# Altium schematic sheet 04_Supply_Monitoring.SchDoc
size A2
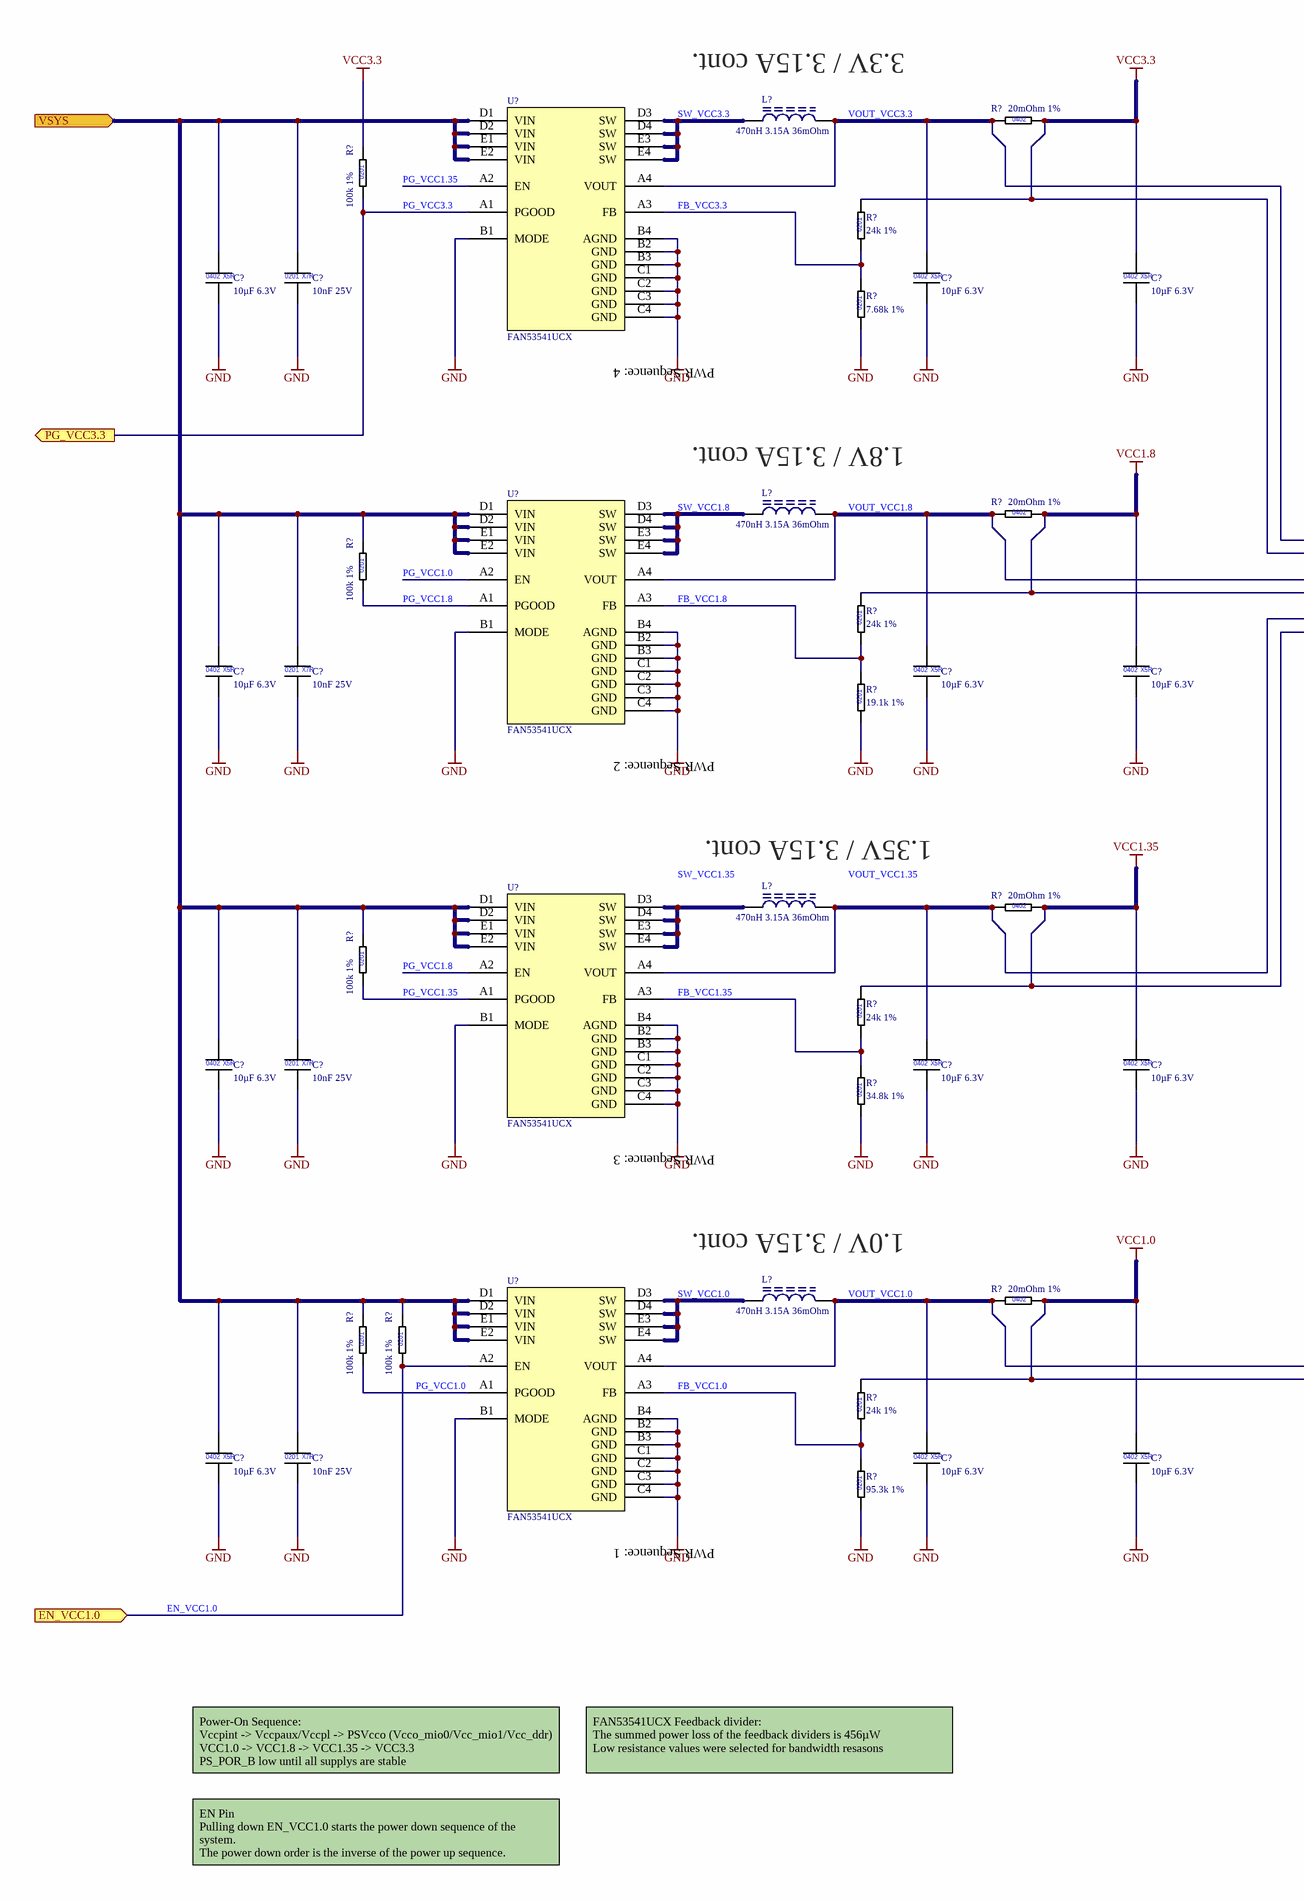
[diagram p0: 04_Supply_Monitoring.SchDoc, left]
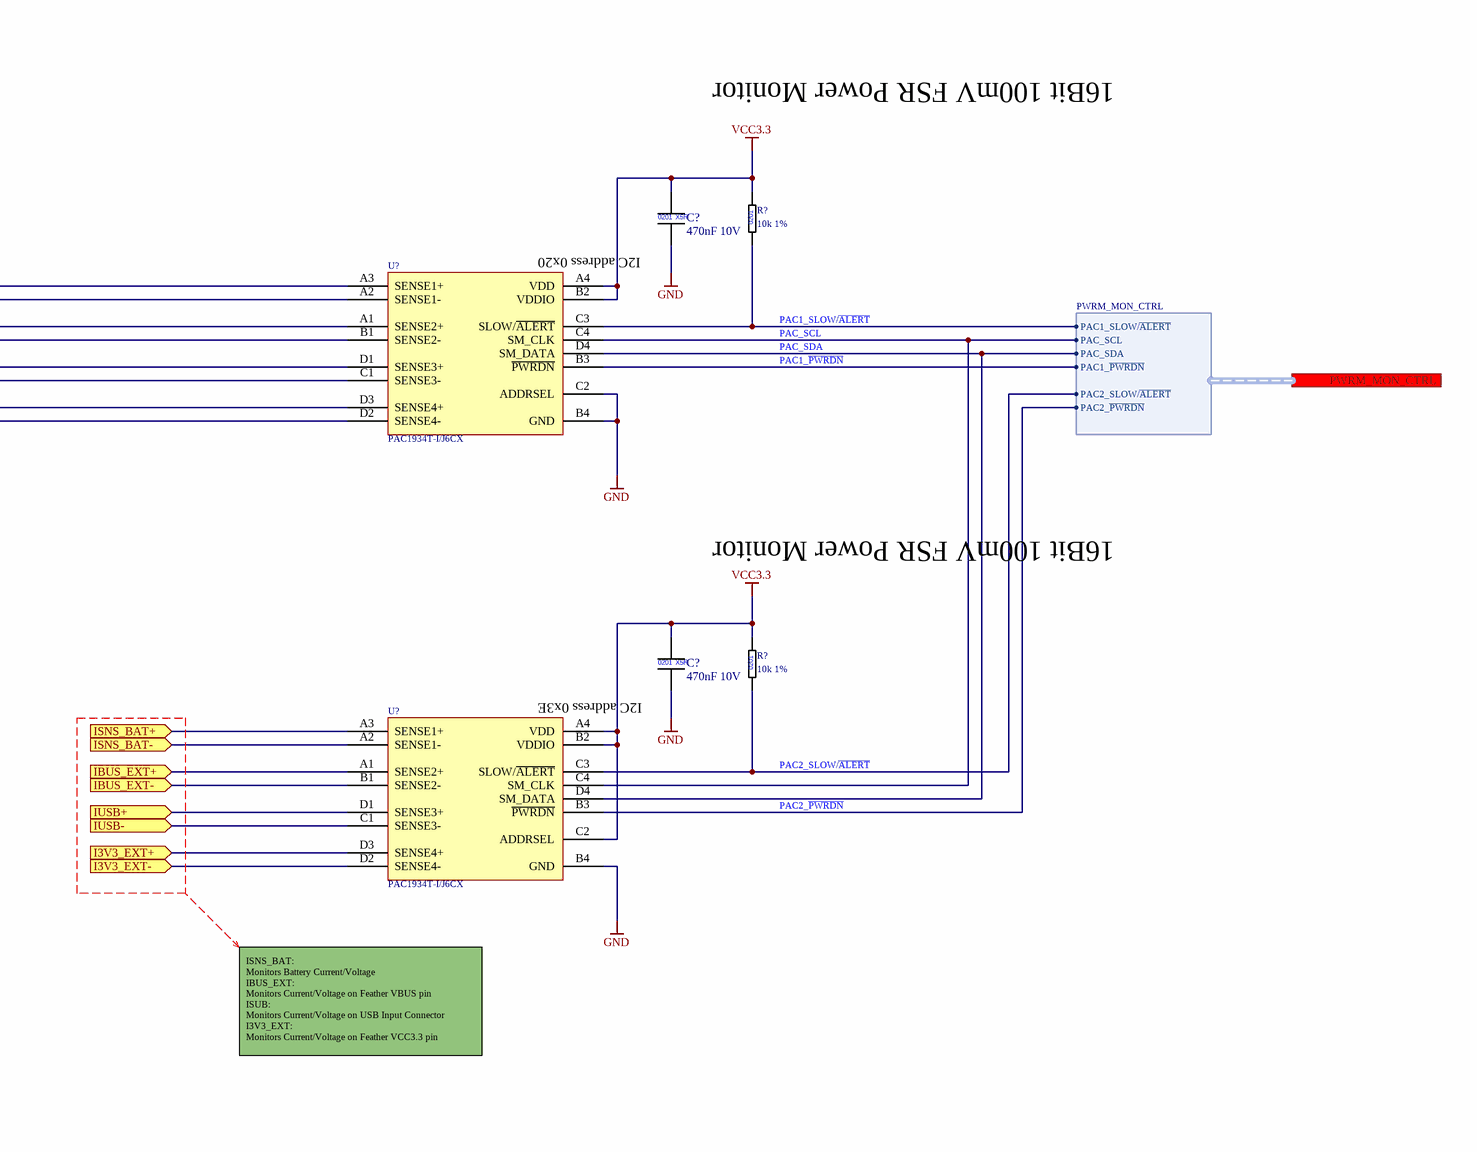
[diagram p1: 04_Supply_Monitoring.SchDoc, right]

## Parts
(Parts that share a designator on the sheet are numbered #1, #2 ... from top to bottom, then left to right.)
C?#1  10µF 6.3V  [CAPC1005X06L]
C?#2  10nF 25V  [CAPC0603X03L]
C?#3  10µF 6.3V  [CAPC1005X06L]
C?#4  10µF 6.3V  [CAPC1005X06L]
C?#5  470nF 10V  [CAPC0603X03L]
C?#6  10µF 6.3V  [CAPC1005X06L]
C?#7  10nF 25V  [CAPC0603X03L]
C?#8  10µF 6.3V  [CAPC1005X06L]
C?#9  10µF 6.3V  [CAPC1005X06L]
C?#10  470nF 10V  [CAPC0603X03L]
C?#11  10µF 6.3V  [CAPC1005X06L]
C?#12  10nF 25V  [CAPC0603X03L]
C?#13  10µF 6.3V  [CAPC1005X06L]
C?#14  10µF 6.3V  [CAPC1005X06L]
C?#15  10µF 6.3V  [CAPC1005X06L]
C?#16  10nF 25V  [CAPC0603X03L]
C?#17  10µF 6.3V  [CAPC1005X06L]
C?#18  10µF 6.3V  [CAPC1005X06L]
L?#1  470nH 3.15A 36mOhm  [INDC2013X08L]
L?#2  470nH 3.15A 36mOhm  [INDC2013X08L]
L?#3  470nH 3.15A 36mOhm  [INDC2013X08L]
L?#4  470nH 3.15A 36mOhm  [INDC2013X08L]
R?#1  20mOhm 1%  [RESC1005X04L]
R?#2  100k 1%  [RESC0603X03L]
R?#3  24k 1%  [RESC0603X03L]
R?#4  7.68k 1%  [RESC0603X03L]
R?#5  10k 1%  [RESC0603X03L]
R?#6  20mOhm 1%  [RESC1005X04L]
R?#7  100k 1%  [RESC0603X03L]
R?#8  24k 1%  [RESC0603X03L]
R?#9  19.1k 1%  [RESC0603X03L]
R?#10  20mOhm 1%  [RESC1005X04L]
R?#11  10k 1%  [RESC0603X03L]
R?#12  100k 1%  [RESC0603X03L]
R?#13  24k 1%  [RESC0603X03L]
R?#14  34.8k 1%  [RESC0603X03L]
R?#15  20mOhm 1%  [RESC1005X04L]
R?#16  100k 1%  [RESC0603X03L]
R?#17  100k 1%  [RESC0603X03L]
R?#18  24k 1%  [RESC0603X03L]
R?#19  95.3k 1%  [RESC0603X03L]
U?#1  FAN53541UCX  [BGA20C40P4X5_156X196X59]
U?#2  PAC1934T-I/J6CX  [BGA16C50P4X4_222X217X68]
U?#3  FAN53541UCX  [BGA20C40P4X5_156X196X59]
U?#4  FAN53541UCX  [BGA20C40P4X5_156X196X59]
U?#5  PAC1934T-I/J6CX  [BGA16C50P4X4_222X217X68]
U?#6  FAN53541UCX  [BGA20C40P4X5_156X196X59]

## Ports
EN_VCC1.0 (in), I3V3_EXT+ (in), I3V3_EXT- (in), IBUS_EXT+ (in), IBUS_EXT- (in), ISNS_BAT+ (in), ISNS_BAT- (in), IUSB+ (in), IUSB- (in), PG_VCC3.3 (out), PWRM_MON_CTRL (harness PWRM_MON_CTRL), VSYS (in)

## Harnesses
PWRM_MON_CTRL: PAC1_SLOW/~{ALERT}, PAC_SCL, PAC1_~{PWRDN}, PAC_SDA, PAC2_SLOW/~{ALERT}, PAC2_~{PWRDN}

## Nets
GND: C?#1.2 C?#2.2 C?#3.2 C?#4.2 C?#5.2 C?#6.2 C?#7.2 C?#8.2 C?#9.2 C?#10.2 C?#11.2 C?#12.2 C?#13.2 C?#14.2 C?#15.2 C?#16.2 C?#17.2 C?#18.2 R?#4.1 R?#9.1 R?#14.1 R?#19.1 U?#1.B1(MODE) U?#1.B2(GND) U?#1.B3(GND) U?#1.B4(AGND) U?#1.C1(GND) U?#1.C2(GND) U?#1.C3(GND) U?#1.C4(GND) U?#2.B4(GND) U?#2.C2(ADDRSEL) U?#3.B1(MODE) U?#3.B2(GND) U?#3.B3(GND) U?#3.B4(AGND) U?#3.C1(GND) U?#3.C2(GND) U?#3.C3(GND) U?#3.C4(GND) U?#4.B1(MODE) U?#4.B2(GND) U?#4.B3(GND) U?#4.B4(AGND) U?#4.C1(GND) U?#4.C2(GND) U?#4.C3(GND) U?#4.C4(GND) U?#5.B4(GND) U?#6.B1(MODE) U?#6.B2(GND) U?#6.B3(GND) U?#6.B4(AGND) U?#6.C1(GND) U?#6.C2(GND) U?#6.C3(GND) U?#6.C4(GND)
VCC1.0: C?#18.1 R?#15.2 R?#18.2 U?#2.D2(SENSE4-)
VCC1.8: C?#9.1 R?#6.2 R?#8.2 U?#2.B1(SENSE2-)
VCC1.35: C?#14.1 R?#10.2 R?#13.2 U?#2.C1(SENSE3-)
VCC3.3: C?#4.1 C?#5.1 C?#10.1 R?#1.2 R?#2.2 R?#3.2 R?#5.2 R?#11.2 U?#2.A2(SENSE1-) U?#2.A4(VDD) U?#2.B2(VDDIO) U?#5.A4(VDD) U?#5.B2(VDDIO) U?#5.C2(ADDRSEL)
EN_VCC1.0: R?#17.1 U?#6.A2(EN) ; port EN_VCC1.0
FB_VCC1.0: R?#18.1 R?#19.2 U?#6.A3(FB)
FB_VCC1.8: R?#8.1 R?#9.2 U?#3.A3(FB)
FB_VCC1.35: R?#13.1 R?#14.2 U?#4.A3(FB)
FB_VCC3.3: R?#3.1 R?#4.2 U?#1.A3(FB)
I3V3_EXT+: U?#5.D3(SENSE4+) ; port I3V3_EXT+
I3V3_EXT-: U?#5.D2(SENSE4-) ; port I3V3_EXT-
IBUS_EXT+: U?#5.A1(SENSE2+) ; port IBUS_EXT+
IBUS_EXT-: U?#5.B1(SENSE2-) ; port IBUS_EXT-
ISNS_BAT+: U?#5.A3(SENSE1+) ; port ISNS_BAT+
ISNS_BAT-: U?#5.A2(SENSE1-) ; port ISNS_BAT-
IUSB+: U?#5.D1(SENSE3+) ; port IUSB+
IUSB-: U?#5.C1(SENSE3-) ; port IUSB-
PAC1_~{PWRDN}: U?#2.B3(~{PWRDN}) ; port PWRM_MON_CTRL.PAC1_~{PWRDN}
PAC1_SLOW/~{ALERT}: R?#5.1 U?#2.C3(SLOW/~{ALERT}) ; port PWRM_MON_CTRL.PAC1_SLOW/~{ALERT}
PAC2_~{PWRDN}: U?#5.B3(~{PWRDN}) ; port PWRM_MON_CTRL.PAC2_~{PWRDN}
PAC2_SLOW/~{ALERT}: R?#11.1 U?#5.C3(SLOW/~{ALERT}) ; port PWRM_MON_CTRL.PAC2_SLOW/~{ALERT}
PAC_SCL: U?#2.C4(SM_CLK) U?#5.C4(SM_CLK) ; port PWRM_MON_CTRL.PAC_SCL
PAC_SDA: U?#2.D4(SM_DATA) U?#5.D4(SM_DATA) ; port PWRM_MON_CTRL.PAC_SDA
PG_VCC1.0: R?#16.1 U?#3.A2(EN) U?#6.A1(PGOOD)
PG_VCC1.8: R?#7.1 U?#3.A1(PGOOD) U?#4.A2(EN)
PG_VCC1.35: R?#12.1 U?#1.A2(EN) U?#4.A1(PGOOD)
PG_VCC3.3: R?#2.1 U?#1.A1(PGOOD) ; port PG_VCC3.3
SW_VCC1.0: L?#4.1 U?#6.D3(SW) U?#6.D4(SW) U?#6.E3(SW) U?#6.E4(SW)
SW_VCC1.8: L?#2.1 U?#3.D3(SW) U?#3.D4(SW) U?#3.E3(SW) U?#3.E4(SW)
SW_VCC3.3: L?#1.1 U?#1.D3(SW) U?#1.D4(SW) U?#1.E3(SW) U?#1.E4(SW)
VOUT_VCC1.0: C?#17.1 L?#4.2 R?#15.1 U?#2.D3(SENSE4+) U?#6.A4(VOUT)
VOUT_VCC1.8: C?#8.1 L?#2.2 R?#6.1 U?#2.A1(SENSE2+) U?#3.A4(VOUT)
VOUT_VCC3.3: C?#3.1 L?#1.2 R?#1.1 U?#1.A4(VOUT) U?#2.A3(SENSE1+)
VSYS: C?#1.1 C?#2.1 C?#6.1 C?#7.1 C?#11.1 C?#12.1 C?#15.1 C?#16.1 R?#7.2 R?#12.2 R?#16.2 R?#17.2 U?#1.D1(VIN) U?#1.D2(VIN) U?#1.E1(VIN) U?#1.E2(VIN) U?#3.D1(VIN) U?#3.D2(VIN) U?#3.E1(VIN) U?#3.E2(VIN) U?#4.D1(VIN) U?#4.D2(VIN) U?#4.E1(VIN) U?#4.E2(VIN) U?#6.D1(VIN) U?#6.D2(VIN) U?#6.E1(VIN) U?#6.E2(VIN) ; port VSYS
NetC?#13_1: C?#13.1 L?#3.2 R?#10.1 U?#2.D1(SENSE3+) U?#4.A4(VOUT)
NetL?#3_1: L?#3.1 U?#4.D3(SW) U?#4.D4(SW) U?#4.E3(SW) U?#4.E4(SW)

## Notes on the sheet
- (near U?#1) 3.3V / 3.15A cont.
- (near U?#1) PWR Sequence: 4
- 16Bit 100mV FSR Power Monitor
- (near U?#3) 1.8V / 3.15A cont.
- (near U?#2) I2C address 0x20
- (near U?#3) PWR Sequence: 2
- (near U?#4) 1.35V / 3.15A cont.
- (near U?#5) I2C address 0x3E
- (near U?#4) PWR Sequence: 3
- (near U?#6) 1.0V / 3.15A cont.
- ISNS_BAT:
  Monitors Battery Current/Voltage
  IBUS_EXT:
  Monitors Current/Voltage on Feather VBUS pin
  ISUB:
  Monitors Current/Voltage on USB Input Connector
  I3V3_EXT:
  Monitors Current/Voltage on Feather VCC3.3 pin
- (near U?#6) PWR Sequence: 1
- Power-On Sequence:
  Vccpint -> Vccpaux/Vccpl -> PSVcco (Vcco_mio0/Vcc_mio1/Vcc_ddr)
  VCC1.0 -> VCC1.8 -> VCC1.35 -> VCC3.3
  PS_POR_B low until all supplys are stable
- FAN53541UCX Feedback divider:
  The summed power loss of the feedback dividers is 456µW
  Low resistance values were selected for bandwidth resasons
- EN Pin
  Pulling down EN_VCC1.0 starts the power down sequence of the system.
  The power down order is the inverse of the power up sequence.
  Floating the EN_VCC1.0 signal starts the power up sequence
- Labels drawn without touching a wire or pin: SW_VCC1.35, VOUT_VCC1.35
- Title:
- ++CONFIDENTIAL++
- The  information  contained  in  these  documents  is  confidential,  privileged  and  only  for  the
  information of the intended recipient and may
  not be used, published or redistributed without
  the prior written consent from PCB Arts GmbH.
- Datum:
- Revision:
- Blatt:
- von:
- Zeit:
- Entwickler:
- Checked:
- Der transparenteste Entwicklungsdienstleister
  der Elektronik- und Softwareentwicklung
- https://pcb-arts.com/
- mail@pcb-arts.com
- (in symbol CAP_0201_10nF_25V) 0201; X7R
- (in symbol CAP_0201_470nF_10V) 0201; X5R
- (in symbol CAP_0402_10µ_6.3V) 0402; X5R
- (in symbol RES_0201_7.68k_1%) 0201
- (in symbol RES_0201_10k_1%) 0201
- (in symbol RES_0201_19.1k_1%) 0201
- (in symbol RES_0201_24k_1%) 0201
- (in symbol RES_0201_34.8k_1%) 0201
- (in symbol RES_0201_95.3k_1%) 0201
- (in symbol RES_0201_100k_1%) 0201
- (in symbol RES_0402_20mR_1%) 0402

## Library data of the parts
C?#1 C?#3 C?#4 C?#6 C?#8 C?#9 C?#11 C?#13-C?#15 C?#17 C?#18 = CAP_0402_10µ_6.3V: Multilayer Ceramic Capacitors MLCC - SMD/SMT 0402 6.3VDC; Manufacturer 1: Murata Electronics; Manufacturer 1 Prt. Nr.: GRM155C80J106ME11J; Manufacturer 2 Prt. Nr.: JMK105CBJ106MV-F; Manufacturer 2: Taiyo Yuden
C?#2 C?#7 C?#12 C?#16 = CAP_0201_10nF_25V: Multilayer Ceramic Capacitors MLCC - SMD/SMT 0201 25VDC; Manufacturer: Murata Electronics; Manufacturer Prt. Nr.: GRM033C81E103KE14D; Manufacturer 2: AVX; Manufacturer Prt. Nr. 2: 02013C103KAT2A
C?#5 C?#10 = CAP_0201_470nF_10V: Multilayer Ceramic Capacitors MLCC - SMD/SMT 0201 10VDC; Manufacturer 1: Taiyo Yuden; Manufacturer 1 Prt. Nr.: LMK063BBJ474KPLF; Manufacturer 2 Prt. Nr.: C0603X5R1A474M030BC; Manufacturer 2: TDK
L?#1-L?#4 = IND_0805_470nH_3.15A: Fixed Inductors 0805 .47uH 3.15A 20% 36mOhms HiCur; Manufacturer Prt. Nr.: MCHK2012TR47M; Manufacturer: Taiyo Yuden
R?#1 R?#6 R?#10 R?#15 = RES_0402_20mR_1%: Thick Film Resistors - SMD 20mOHM 1%; Manufacturer 1: Yageo; Manufacturer 1 Prt. Nr.: PA0402FRL7T0R02L
R?#2 R?#7 R?#12 R?#16 R?#17 = RES_0201_100k_1%: Thick Film Resistors - SMD 100K OHM 1%; Manufacturer 1: Yageo; Manufacturer 1 Prt. Nr.: RC0201FR-07100KL; Manufacturer 2 Prt. Nr.: CRCW0201100KFNED; Manufacturer 2: Vishay / Dale
R?#3 R?#8 R?#13 R?#18 = RES_0201_24k_1%: Thick Film Resistors - SMD 24K OHM 1%; Manufacturer 1: Yageo; Manufacturer 1 Prt. Nr.: RC0201FR-0724KL; Manufacturer 2 Prt. Nr.: CRCW020124K0FKED; Manufacturer 2: Vishay / Dale
R?#4 = RES_0201_7.68k_1%: Thick Film Resistors - SMD 7.68K OHM 1%; Manufacturer 1: Yageo; Manufacturer 1 Prt. Nr.: RC0201FR-077K68L; Manufacturer 2 Prt. Nr.: CRCW02017K68FKED; Manufacturer 2: Vishay / Dale
R?#5 R?#11 = RES_0201_10k_1%: Thick Film Resistors - SMD 10K OHM 1%; Manufacturer 1: Yageo; Manufacturer 1 Prt. Nr.: RC0201FR-0710KL; Manufacturer 2 Prt. Nr.: CRCW020110K0FNED; Manufacturer 2: Vishay / Dale
R?#9 = RES_0201_19.1k_1%: Thick Film Resistors - SMD 19.1K OHM 1%; Manufacturer 1: Yageo; Manufacturer 1 Prt. Nr.: RC0201FR-0719K1L; Manufacturer 2 Prt. Nr.: CRCW020119K1FKED; Manufacturer 2: Vishay / Dale
R?#14 = RES_0201_34.8k_1%: Thick Film Resistors - SMD 34.8K OHM 1%; Manufacturer 1: Yageo; Manufacturer 1 Prt. Nr.: RC0201FR-0734K8L; Manufacturer 2 Prt. Nr.: CRCW020134K8FKED; Manufacturer 2: Vishay / Dale
R?#19 = RES_0201_95.3k_1%: Thick Film Resistors - SMD 95.3K OHM 1%; Manufacturer 1: Yageo; Manufacturer 1 Prt. Nr.: RC0201FR-0795K3L; Manufacturer 2 Prt. Nr.: CRCW020195K3FKED; Manufacturer 2: Vishay / Dale
U?#1 U?#3 U?#4 U?#6 = FAN53541UCX_2.4 MHz 5A Synchronous Buck Reg: Switching Voltage Regulators 2.4 MHz 5A Synchronous Buck Reg; Manufacturer: ON Semiconductor / Fairchild; Manufacturer Prt. Nr.: FAN53541UCX
U?#2 U?#5 = PAC1934T-I/J6CX_Quad High-Side Current Sensor, I2C/SMBus: Current & Power Monitors & Regulators Quad High-Side Current Sensor, I2C/SMBus, 32V with Accumulator; Manufacturer 1: Microchip Technology; Manufacturer 1 Prt. Nr.: PAC1934T-I/J6CX